# Altium schematic sheet WiFi.SchDoc
size A4
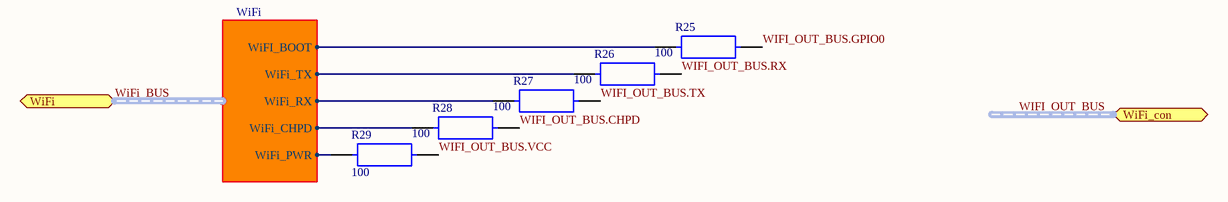
[diagram p0: WiFi.SchDoc]

## Parts
R25  100  [0603R]
R26  100  [0603R]
R27  100  [0603R]
R28  100  [0603R]
R29  100  [0603R]

## Ports
WiFi (harness WiFi), WiFi_con (harness WiFi_connector)

## Harnesses
WiFi: WiFi_PWR, WiFi_CHPD, WiFi_RX, WiFi_TX, WiFI_BOOT

## Nets
WiFi_BUS.WiFI_BOOT: R25.2 ; port WiFi.WiFI_BOOT
WiFi_BUS.WiFi_CHPD: R28.2 ; port WiFi.WiFi_CHPD
WiFi_BUS.WiFi_PWR: R29.2 ; port WiFi.WiFi_PWR
WiFi_BUS.WiFi_RX: R27.2 ; port WiFi.WiFi_RX
WiFi_BUS.WiFi_TX: R26.2 ; port WiFi.WiFi_TX
WIFI_OUT_BUS.CHPD: R28.1
WIFI_OUT_BUS.GPIO0: R25.1
WIFI_OUT_BUS.RX: R26.1
WIFI_OUT_BUS.TX: R27.1
WIFI_OUT_BUS.VCC: R29.1

## Buses and harness runs
harness WiFi_BUS = port WiFi
harness WIFI_OUT_BUS = port WiFi_con

## Library data of the parts
R25-R29 = RES: Резистор обыкновенный; Value: 100